# Altium schematic sheet C-03 eMMC_NAND_TF_QSPI.SchDoc
size 513 x 386 mm
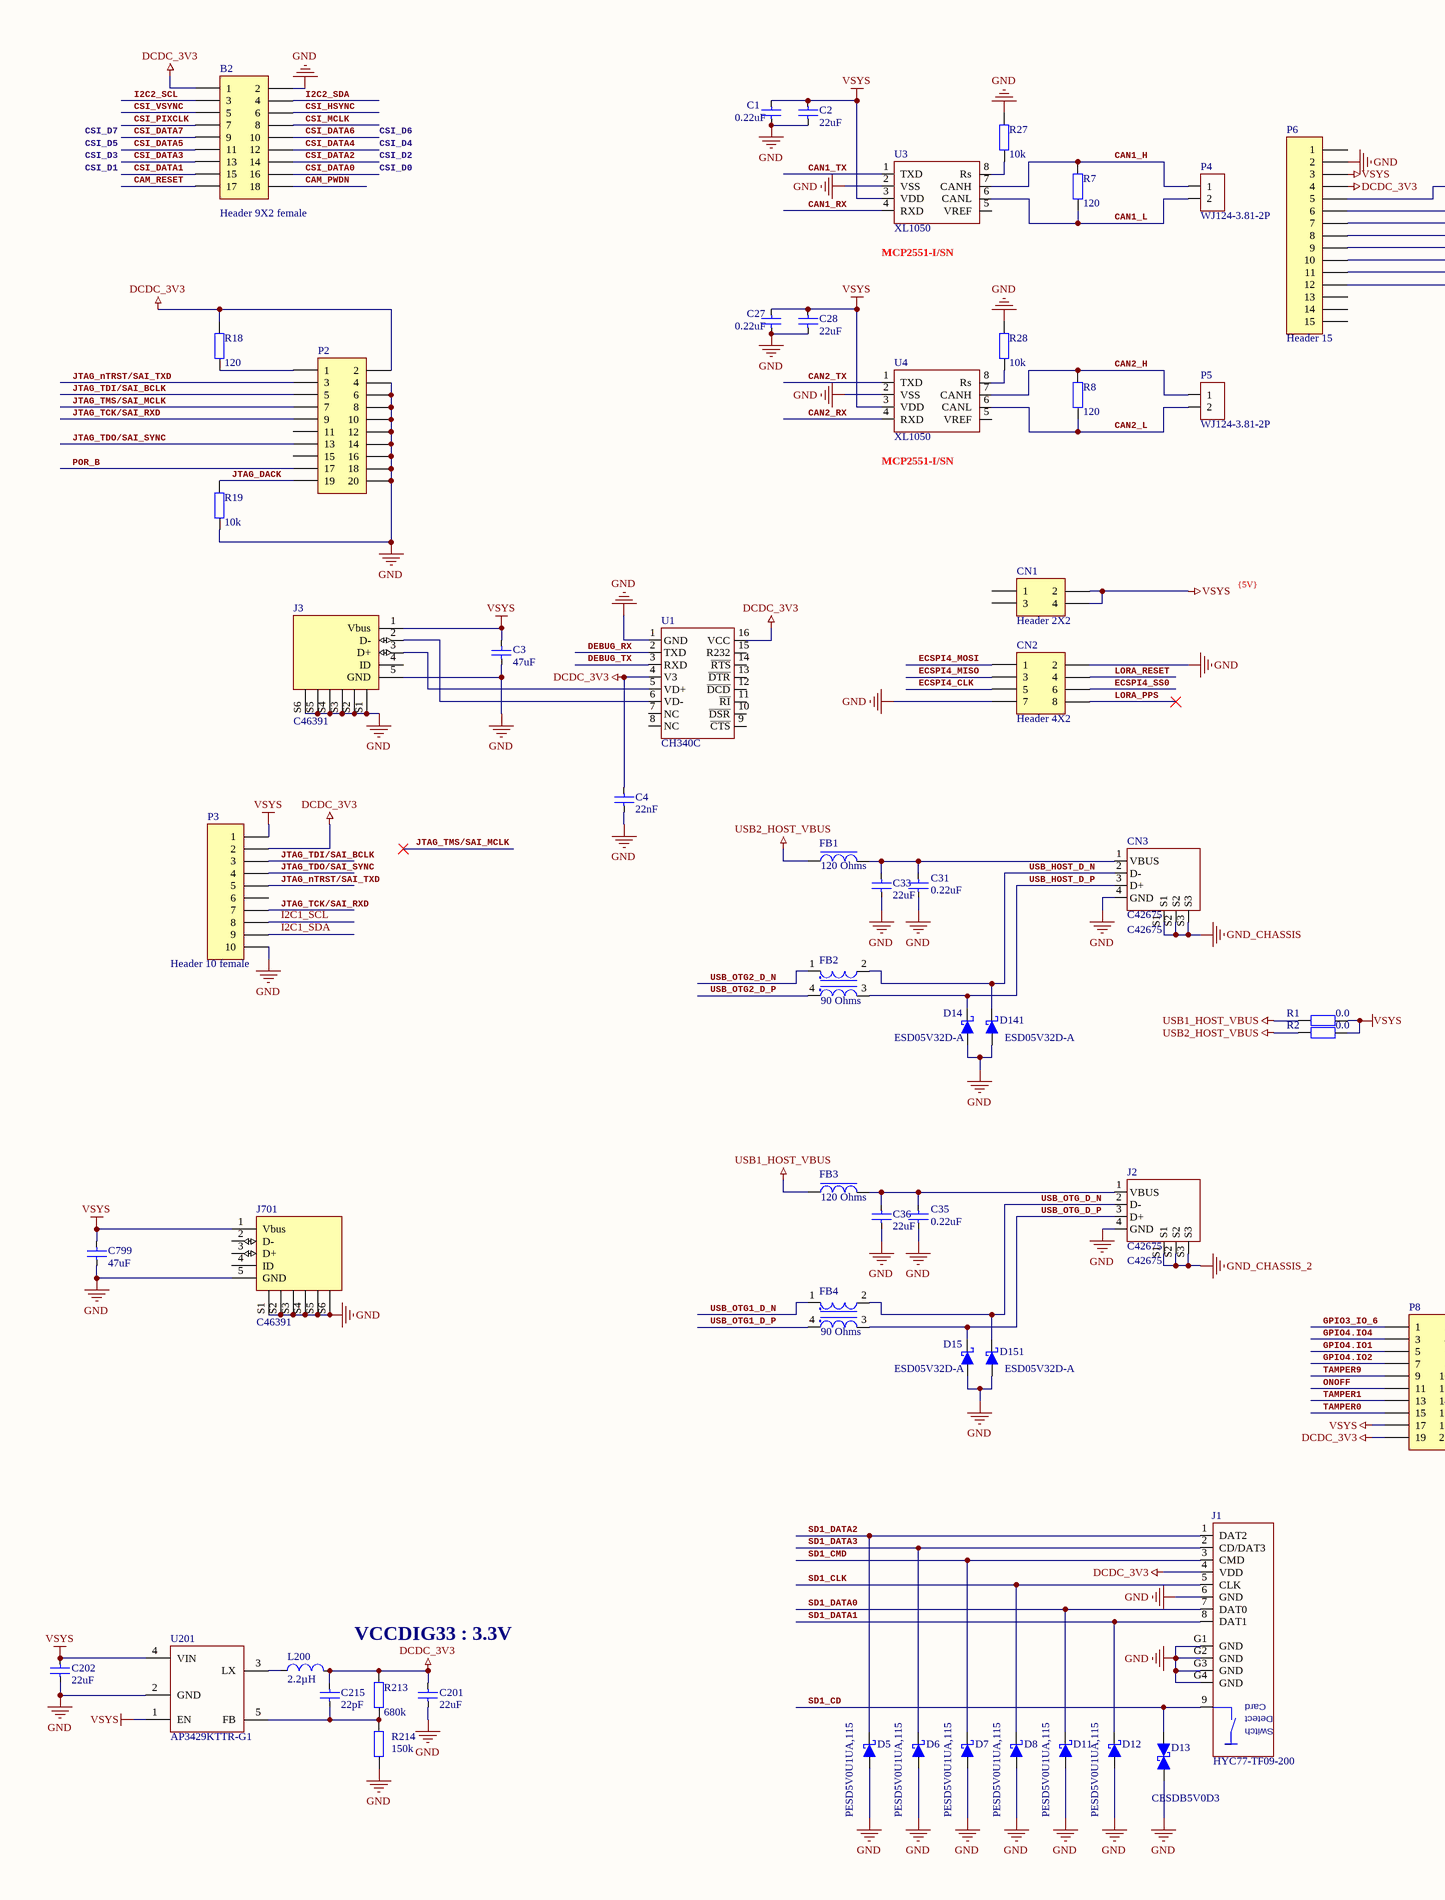
[diagram p0: C-03 eMMC_NAND_TF_QSPI.SchDoc, left]
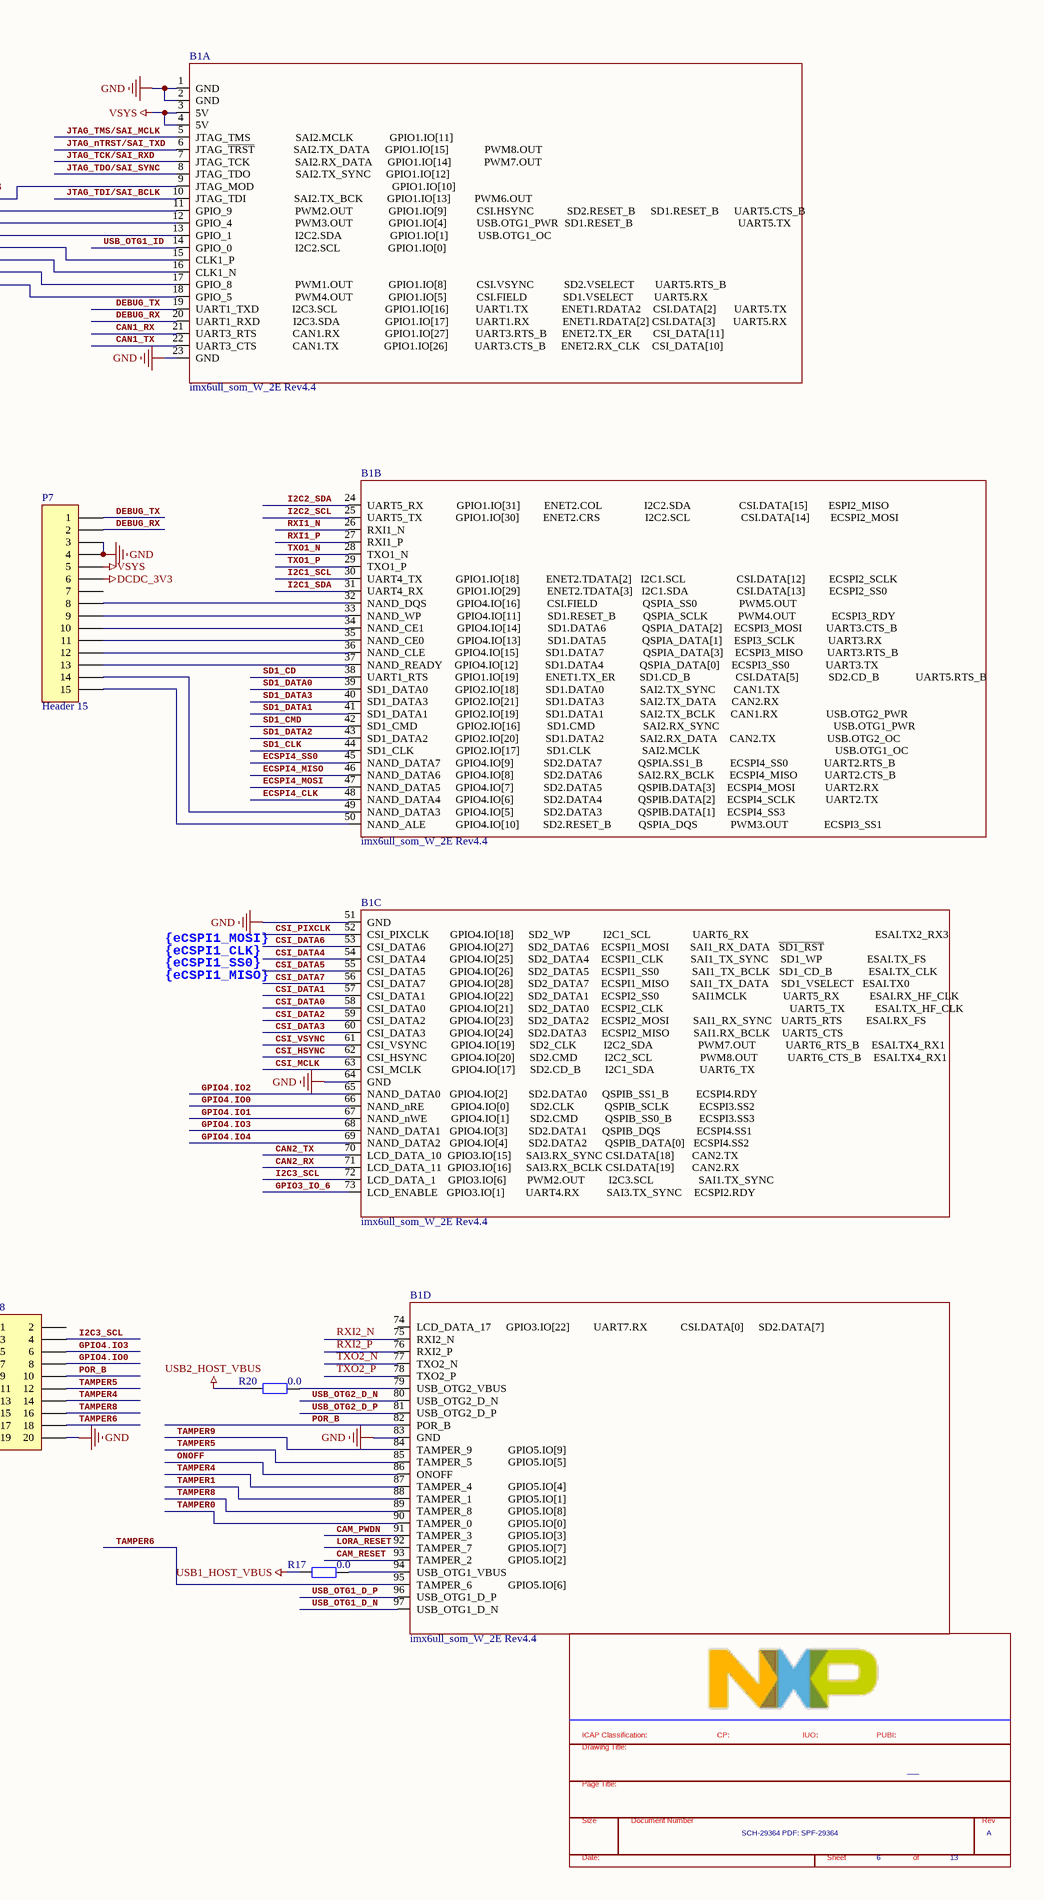
[diagram p1: C-03 eMMC_NAND_TF_QSPI.SchDoc, right]

## Parts
*  PUBI: ___  Doc: SCH-29364 PDF: SPF-29364  RevCode: A  Page Number: 6  Page Count: 13  (hidden comment: TitleBlock_FS)  (graphical)
B1  imx6ull_som_W_2E Rev4.4  [imx6ull_som]  (parts A,B,C,D of 4)
B2  Header 9X2 female  [HDR2X9]
C1  value 0.22uF  [CAP0603R]  (hidden comment: CL10B224KA8NNNC)
C2  value 22uF  [CAP1206R]  (hidden comment: CC1206KKX5R6BB226)
C3  value 47uF  [CAP1206R]  (hidden comment: CL31A476MPHNNNE)
C4  value 22nF  [CAP0603R]  (hidden comment: CC0603KRX7R9BB223)
C27  value 0.22uF  [CAP0603R]  (hidden comment: CL10B224KA8NNNC)
C28  value 22uF  [CAP1206R]  (hidden comment: CC1206KKX5R6BB226)
C31  value 0.22uF  [CAP0603R]  (hidden comment: CL10B224KA8NNNC)
C33  value 22uF  [CAP1206R]  (hidden comment: CC1206KKX5R6BB226)
C35  value 0.22uF  [CAP0603R]  (hidden comment: CL10B224KA8NNNC)
C36  value 22uF  [CAP1206R]  (hidden comment: CC1206KKX5R6BB226)
C201  value 22uF  [CAP1206R]  (hidden comment: CC1206KKX5R6BB226)
C202  value 22uF  [CAP1206R]  (hidden comment: CC1206KKX5R6BB226)
C215  value 22pF  [CAP0603R]  (hidden comment: CC0603JRNPO9BN220)
C799  value 47uF  [CAP1206R]  (hidden comment: CL31A476MPHNNNE)
CN1  Header 2X2  [HDR2X2]
CN2  Header 4X2  [HDR2X4]
CN3  C42675  [C2345-Footprint-1]
D5  PESD5V0U1UA,115  [SOD-323]
D6  PESD5V0U1UA,115  [SOD-323]
D7  PESD5V0U1UA,115  [SOD-323]
D8  PESD5V0U1UA,115  [SOD-323]
D11  PESD5V0U1UA,115  [SOD-323]
D12  PESD5V0U1UA,115  [SOD-323]
D13  CESDB5V0D3  [SOD-323]
D14  ESD05V32D-A  [SOD-323]
D15  ESD05V32D-A  [SOD-323]
D141  ESD05V32D-A  [SOD-323]
D151  ESD05V32D-A  [SOD-323]
FB1  Impedance: 120 Ohms  [0603]  (hidden comment: PZ1608U121-2R0TF)
FB2  Impedance: 90 Ohms  [DLW21HN900SQ2L-Footprint-1]  (hidden comment: DLW21HN900SQ2L)
FB3  Impedance: 120 Ohms  [0603]  (hidden comment: PZ1608U121-2R0TF)
FB4  Impedance: 90 Ohms  [DLW21HN900SQ2L-Footprint-1]  (hidden comment: DLW21HN900SQ2L)
J1  HYC77-TF09-200  [0473521001]
J2  C42675  [C2345-Footprint-1]
J3  C46391  [10118192]
J701  C46391  [10118192]
L200  value 2.2µH  [LQH3225]  (hidden comment: LQH32PN2R2NNCL)
P2  CMP-013-0009-2  [HDR2X10]  (value not drawn)
P3  Header 10 female  [HDR1X10]
P4  WJ124-3.81-2P  [SCREW1X2_3.81mm_pitch]
P5  WJ124-3.81-2P  [SCREW1X2_3.81mm_pitch]
P6  Header 15  [HDR1X15]
P7  Header 15  [HDR1X15]
P8  CMP-013-0009-2  [HDR2X10]  (value not drawn)
R1  value 0.0  [0603]  (hidden comment: CMP-022-0120-1)
R2  value 0.0  [0603]  (hidden comment: CMP-022-0120-1)
R7  value 120  [0603]  (hidden comment: 0603WAF1200T5E)
R8  value 120  [0603]  (hidden comment: 0603WAF1200T5E)
R17  value 0.0  [0603]  (hidden comment: RC0603JR-070RL)
R18  value 120  [0603]  (hidden comment: 0603WAF1200T5E)
R19  value 10k  [0603]  (hidden comment: 0603WAF1002T5E)
R20  value 0.0  [0603]  (hidden comment: CMP-022-0120-1)
R27  value 10k  [0603]  (hidden comment: 0603WAF1002T5E)
R28  value 10k  [0603]  (hidden comment: 0603WAF1002T5E)
R213  value 680k  [0603]  (hidden comment: 0603WAF6803T5E)
R214  value 150k  [0603]  (hidden comment: 0603WAF1503T5E)
U1  CH340C  [SOIC-16_N]
U3  XL1050  [SOIC-8_N]
U4  XL1050  [SOIC-8_N]
U201  AP3429KTTR-G1  [TSOT-23-5]

## Nets
DCDC_3V3: B2.1 C4.2 C201.1 C215.2 J1.4(VDD) L200.2 P2.2 P3.2 P6.4 P7.6 P8.19 R18.2 R213.2 U1.4(V3) U1.16(VCC)
GND: B1.1(GND) B1.2(GND) B1.23(GND) B1.51(GND) B1.64(GND) B1.83(GND) B2.2 C1.1 C2.2 C3.1 C4.1 C27.1 C28.2 C31.1 C33.2 C35.1 C36.2 C201.2 C202.2 C799.1 CN2.2 CN2.7 CN3.4(GND) D5.2(A) D6.2(A) D7.2(A) D8.2(A) D11.2(A) D12.2(A) D13.2(A) D14.2(A) D15.2(A) D141.2(A) D151.2(A) J1.6(GND) J1.G1(GND) J1.G2(GND) J1.G3(GND) J1.G4(GND) J2.4(GND) J3.5(GND) J3.S1 J3.S2 J3.S3 J3.S4 J3.S5 J3.S6 J701.5(GND) J701.S1 J701.S2 J701.S3 J701.S4 J701.S5 J701.S6 P2.4 P2.6 P2.8 P2.10 P2.12 P2.14 P2.16 P2.18 P2.20 P3.10 P6.2 P7.3 P7.4 P8.20 R19.1 R27.2 R28.2 R214.1 U1.1(GND) U3.2(VSS) U4.2(VSS) U201.2(GND)
GND_CHASSIS: CN3.S1 CN3.S2 CN3.S3
GND_CHASSIS_2: J2.S1 J2.S2 J2.S3
USB1_HOST_VBUS: FB3.2 R1.1 R17.1
USB2_HOST_VBUS: FB1.2 R2.1 R20.1
VSYS: B1.3(5V) B1.4(5V) C1.2 C2.1 C3.2 C27.2 C28.1 C202.1 C799.2 CN1.2 CN1.4 J3.1(Vbus) J701.1(Vbus) P3.1 P6.3 P7.5 P8.17 R1.2 R2.2 U3.3(VDD) U4.3(VDD) U201.1(EN) U201.4(VIN)
CAM_PWDN: B1.91(TAMPER_3____________GPIO5.IO[3]) B2.18
CAM_RESET: B1.93(TAMPER_2____________GPIO5.IO[2]) B2.17
CAN1_H: P4.1 R7.2 U3.7(CANH)
CAN1_L: P4.2 R7.1 U3.6(CANL)
CAN1_RX: B1.21(UART3_RTS____________CAN1.RX_______________GPIO1.IO[27]_________UART3.RTS_B_____ENET2.TX_ER_______CSI_DATA[11]) U3.4(RXD)
CAN1_TX: B1.22(UART3_CTS____________CAN1.TX_______________GPIO1.IO[26]_________UART3.CTS_B_____ENET2.RX_CLK____CSI_DATA[10]) U3.1(TXD)
CAN2_H: P5.1 R8.2 U4.7(CANH)
CAN2_L: P5.2 R8.1 U4.6(CANL)
CAN2_RX: B1.71(LCD_DATA_11__GPIO3.IO[16]_____SAI3.RX_BCLK_CSI.DATA[19]______CAN2.RX) U4.4(RXD)
CAN2_TX: B1.70(LCD_DATA_10__GPIO3.IO[15]_____SAI3.RX_SYNC_CSI.DATA[18]______CAN2.TX) U4.1(TXD)
CSI_DATA0: B1.58(CSI_DATA0________GPIO4.IO[21]_____SD2_DATA0____ECSPI2_CLK__________________________________________UART5_TX__________ESAI.TX_HF_CLK) B2.16
CSI_DATA1: B1.57(CSI_DATA1________GPIO4.IO[22]_____SD2_DATA1____ECSPI2_SS0___________SAI1MCLK____________UART5_RX__________ESAI.RX_HF_CLK) B2.15
CSI_DATA2: B1.59(CSI_DATA2________GPIO4.IO[23]_____SD2_DATA2____ECSPI2_MOSI________SAI1_RX_SYNC___UART5_RTS________ESAI.RX_FS) B2.14
CSI_DATA3: B1.60(CSI_DATA3________GPIO4.IO[24]_____SD2.DATA3_____ECSPI2_MISO________SAI1.RX_BCLK____UART5_CTS) B2.13
CSI_DATA4: B1.54(CSI_DATA4________GPIO4.IO[25]_____SD2_DATA4____ECSPI1_CLK_________SAI1_TX_SYNC____SD1_WP_______________ESAI.TX_FS) B2.12
CSI_DATA5: B1.55(CSI_DATA5________GPIO4.IO[26]_____SD2_DATA5____ECSPI1_SS0___________SAI1_TX_BCLK___SD1_CD_B____________ESAI.TX_CLK) B2.11
CSI_DATA6: B1.53(CSI_DATA6________GPIO4.IO[27]_____SD2_DATA6____ECSPI1_MOSI_______SAI1_RX_DATA___~{SD1_RST}) B2.10
CSI_DATA7: B1.56(CSI_DATA7________GPIO4.IO[28]_____SD2_DATA7____ECSPI1_MISO_______SAI1_TX_DATA____SD1_VSELECT___ESAI.TX0) B2.9
CSI_HSYNC: B1.62(CSI_HSYNC________GPIO4.IO[20]_____SD2.CMD_________I2C2_SCL________________PWM8.OUT__________UART6_CTS_B____ESAI.TX4_RX1) B2.6
CSI_MCLK: B1.63(CSI_MCLK__________GPIO4.IO[17]_____SD2.CD_B________I2C1_SDA_______________UART6_TX) B2.8
CSI_PIXCLK: B1.52(CSI_PIXCLK_______GPIO4.IO[18]_____SD2_WP___________I2C1_SCL______________UART6_RX__________________________________________ESAI.TX2_RX3) B2.7
CSI_VSYNC: B1.61(CSI_VSYNC________GPIO4.IO[19]_____SD2_CLK_________I2C2_SDA_______________PWM7.OUT__________UART6_RTS_B____ESAI.TX4_RX1) B2.5
DEBUG_RX: B1.20(UART1_RXD___________I2C3.SDA_______________GPIO1.IO[17]_________UART1.RX___________ENET1.RDATA[2]_CSI.DATA[3]______UART5.RX) P7.2 U1.2(TXD)
DEBUG_TX: B1.19(UART1_TXD___________I2C3.SCL________________GPIO1.IO[16]_________UART1.TX___________ENET1.RDATA2____CSI.DATA[2]______UART5.TX) P7.1 U1.3(RXD)
ECSPI4_CLK: B1.48(NAND_DATA4_____GPIO4.IO[6]__________SD2.DATA4____________QSPIB.DATA[2]____ECSPI4_SCLK__________UART2.TX) CN2.5
ECSPI4_MISO: B1.46(NAND_DATA6_____GPIO4.IO[8]__________SD2.DATA6____________SAI2.RX_BCLK_____ECSPI4_MISO_________UART2.CTS_B) CN2.3
ECSPI4_MOSI: B1.47(NAND_DATA5_____GPIO4.IO[7]__________SD2.DATA5____________QSPIB.DATA[3]____ECSPI4_MOSI__________UART2.RX) CN2.1
ECSPI4_SS0: B1.45(NAND_DATA7_____GPIO4.IO[9]__________SD2.DATA7____________QSPIA.SS1_B_________ECSPI4_SS0____________UART2.RTS_B) CN2.6
GPIO3_IO_6: B1.73(LCD_ENABLE___GPIO3.IO[1]_______UART4.RX_________SAI3.TX_SYNC____ECSPI2.RDY) P8.1
GPIO4.IO0: B1.66(NAND_nRE_________GPIO4.IO[0]_______SD2.CLK__________QSPIB_SCLK__________ECSPI3.SS2) P8.8
GPIO4.IO1: B1.67(NAND_nWE________GPIO4.IO[1]_______SD2.CMD_________QSPIB_SS0_B_________ECSPI3.SS3) P8.5
GPIO4.IO2: B1.65(NAND_DATA0___GPIO4.IO[2]_______SD2.DATA0_____QSPIB_SS1_B_________ECSPI4.RDY) P8.7
GPIO4.IO3: B1.68(NAND_DATA1___GPIO4.IO[3]_______SD2.DATA1_____QSPIB_DQS____________ECSPI4.SS1) P8.6
GPIO4.IO4: B1.69(NAND_DATA2___GPIO4.IO[4]_______SD2.DATA2______QSPIB_DATA[0]___ECSPI4.SS2) P8.3
I2C1_SCL: B1.30(UART4_TX___________GPIO1.IO[18]_________ENET2.TDATA[2]___I2C1.SCL_________________CSI.DATA[12]________ECSPI2_SCLK) P3.8
I2C1_SDA: B1.31(UART4_RX___________GPIO1.IO[29]_________ENET2.TDATA[3]___I2C1.SDA________________CSI.DATA[13]________ECSPI2_SS0) P3.9
I2C2_SCL: B1.25(UART5_TX___________GPIO1.IO[30]________ENET2.CRS_______________I2C2.SCL_________________CSI.DATA[14]_______ECSPI2_MOSI) B2.3
I2C2_SDA: B1.24(UART5_RX___________GPIO1.IO[31]________ENET2.COL______________I2C2.SDA________________CSI.DATA[15]_______ESPI2_MISO) B2.4
I2C3_SCL: B1.72(LCD_DATA_1____GPIO3.IO[6]_______PWM2.OUT________I2C3.SCL_______________SAI1.TX_SYNC) P8.4
JTAG_DACK: P2.19 R19.2
JTAG_nTRST/SAI_TXD: B1.6(JTAG_~{TRST}_____________SAI2.TX_DATA_____GPIO1.IO[15]____________PWM8.OUT) P2.3 P3.5
JTAG_TCK/SAI_RXD: B1.7(JTAG_TCK_______________SAI2.RX_DATA_____GPIO1.IO[14]___________PWM7.OUT) P2.9 P3.7
JTAG_TDI/SAI_BCLK: B1.10(JTAG_TDI________________SAI2.TX_BCK________GPIO1.IO[13]________PWM6.OUT) P2.5 P3.3
JTAG_TDO/SAI_SYNC: B1.8(JTAG_TDO_______________SAI2.TX_SYNC_____GPIO1.IO[12]) P2.13 P3.4
JTAG_TMS/SAI_MCLK: B1.5(JTAG_TMS_______________SAI2.MCLK____________GPIO1.IO[11]) P2.7
LORA_PPS: CN2.8
LORA_RESET: B1.92(TAMPER_7____________GPIO5.IO[7]) CN2.4
ONOFF: B1.86(ONOFF) P8.11
POR_B: B1.82(POR_B) P2.17 P8.10
RXI1_N: B1.26(RXI1_N)
RXI1_P: B1.27(RXI1_P)
RXI2_N: B1.75(RXI2_N)
RXI2_P: B1.76(RXI2_P)
SD1_CD: B1.38(UART1_RTS_________GPIO1.IO[19]_________ENET1.TX_ER________SD1.CD_B_______________CSI.DATA[5]__________SD2.CD_B____________UART5.RTS_B) D13.1(K) J1.9(CDSW)
SD1_CLK: B1.44(SD1_CLK______________GPIO2.IO[17]_________SD1.CLK_________________SAI2.MCLK_____________________________________________USB.OTG1_OC) D8.1(K) J1.5(CLK)
SD1_CMD: B1.42(SD1_CMD_____________GPIO2.IO[16]_________SD1.CMD________________SAI2.RX_SYNC______________________________________USB.OTG1_PWR) D7.1(K) J1.3(CMD)
SD1_DATA0: B1.39(SD1_DATA0_________GPIO2.IO[18]_________SD1.DATA0____________SAI2.TX_SYNC______CAN1.TX) D11.1(K) J1.7(DAT0)
SD1_DATA1: B1.41(SD1_DATA1_________GPIO2.IO[19]_________SD1.DATA1____________SAI2.TX_BCLK_____CAN1.RX________________USB.OTG2_PWR) D12.1(K) J1.8(DAT1)
SD1_DATA2: B1.43(SD1_DATA2_________GPIO2.IO[20]_________SD1.DATA2____________SAI2.RX_DATA____CAN2.TX_________________USB.OTG2_OC) D5.1(K) J1.1(DAT2)
SD1_DATA3: B1.40(SD1_DATA3_________GPIO2.IO[21]_________SD1.DATA3____________SAI2.TX_DATA_____CAN2.RX) D6.1(K) J1.2(CD/DAT3)
TAMPER0: B1.90(TAMPER_0____________GPIO5.IO[0]) P8.15
TAMPER1: B1.88(TAMPER_1____________GPIO5.IO[1]) P8.13
TAMPER4: B1.87(TAMPER_4____________GPIO5.IO[4]) P8.14
TAMPER5: B1.85(TAMPER_5____________GPIO5.IO[5]) P8.12
TAMPER6: B1.95(TAMPER_6____________GPIO5.IO[6]) P8.18
TAMPER8: B1.89(TAMPER_8____________GPIO5.IO[8]) P8.16
TAMPER9: B1.84(TAMPER_9____________GPIO5.IO[9]) P8.9
TXO1_N: B1.28(TXO1_N)
TXO1_P: B1.29(TXO1_P)
TXO2_N: B1.77(TXO2_N)
TXO2_P: B1.78(TXO2_P)
USB_HOST_D_N: CN3.2(D-) D141.1(K) FB2.2
USB_HOST_D_P: CN3.3(D+) D14.1(K) FB2.3
USB_OTG1_D_N: B1.97(USB_OTG1_D_N) FB4.1
USB_OTG1_D_P: B1.96(USB_OTG1_D_P) FB4.4
USB_OTG1_ID: B1.14(GPIO_0_____________________I2C2.SCL________________GPIO1.IO[0])
USB_OTG2_D_N: B1.80(USB_OTG2_D_N) FB2.1
USB_OTG2_D_P: B1.81(USB_OTG2_D_P) FB2.4
USB_OTG_D_N: D151.1(K) FB4.2 J2.2(D-)
USB_OTG_D_P: D15.1(K) FB4.3 J2.3(D+)
NetB1_9: B1.9(JTAG_MOD______________________________________________GPIO1.IO[10]) P6.5
NetB1_11: B1.11(GPIO_9_____________________PWM2.OUT____________GPIO1.IO[9]__________CSI.HSYNC___________SD2.RESET_B_____SD1.RESET_B_____UART5.CTS_B) P6.6
NetB1_12: B1.12(GPIO_4_____________________PWM3.OUT____________GPIO1.IO[4]__________USB.OTG1_PWR__SD1.RESET_B___________________________________UART5.TX) P6.7
NetB1_13: B1.13(GPIO_1_____________________I2C2.SDA________________GPIO1.IO[1]__________USB.OTG1_OC) P6.8
NetB1_15: B1.15(CLK1_P) P6.9
NetB1_16: B1.16(CLK1_N) P6.10
NetB1_17: B1.17(GPIO_8_____________________PWM1.OUT____________GPIO1.IO[8]__________CSI.VSYNC__________SD2.VSELECT_______UART5.RTS_B) P6.11
NetB1_18: B1.18(GPIO_5_____________________PWM4.OUT____________GPIO1.IO[5]__________CSI.FIELD____________SD1.VSELECT_______UART5.RX) P6.12
NetB1_32: B1.32(NAND_DQS__________GPIO4.IO[16]_________CSI.FIELD_______________QSPIA_SS0______________PWM5.OUT) P7.8
NetB1_33: B1.33(NAND_WP____________GPIO4.IO[11]_________SD1.RESET_B_________QSPIA_SCLK__________PWM4.OUT____________ECSPI3_RDY) P7.9
NetB1_34: B1.34(NAND_CE1___________GPIO4.IO[14]_________SD1.DATA6____________QSPIA_DATA[2]____ECSPI3_MOSI________UART3.CTS_B) P7.10
NetB1_35: B1.35(NAND_CE0___________GPIO4.IO[13]_________SD1.DATA5____________QSPIA_DATA[1]____ESPI3_SCLK___________UART3.RX) P7.11
NetB1_36: B1.36(NAND_CLE__________GPIO4.IO[15]_________SD1.DATA7_____________QSPIA_DATA[3]____ECSPI3_MISO________UART3.RTS_B) P7.12
NetB1_37: B1.37(NAND_READY____GPIO4.IO[12]_________SD1.DATA4____________QSPIA_DATA[0]____ECSPI3_SS0____________UART3.TX) P7.13
NetB1_49: B1.49(NAND_DATA3_____GPIO4.IO[5]__________SD2.DATA3____________QSPIB.DATA[1]____ECSPI4_SS3) P7.14
NetB1_50: B1.50(NAND_ALE__________GPIO4.IO[10]________SD2.RESET_B_________QSPIA_DQS___________PWM3.OUT____________ECSPI3_SS1) P7.15
NetB1_79: B1.79(USB_OTG2_VBUS) R20.2
NetB1_94: B1.94(USB_OTG1_VBUS) R17.2
NetC31_2: C31.2 C33.1 CN3.1(VBUS) FB1.1
NetC35_2: C35.2 C36.1 FB3.1 J2.1(VBUS)
NetC215_1: C215.1 R213.1 R214.2 U201.5(FB)
NetJ3_2: J3.2(D-) U1.6(VD-)
NetJ3_3: J3.3(D+) U1.5(VD+)
NetL200_1: L200.1 U201.3(LX)
NetP2_1: P2.1 R18.1
NetR27_1: R27.1 U3.8(Rs)
NetR28_1: R28.1 U4.8(Rs)

Not connected (* = marked no-connect by the designer): B1 74(LCD_DATA_17_____GPIO3.IO[22]________UART7.RX___________CSI.DATA[0]_____SD2.DATA[7]); CN1 1 3; J3 4(ID); J701 2(D-) 3(D+) 4(ID); P2 11 15; P3 6; P6 1 13 14 15; P7 7; P8 2; U1 7(NC) 8(NC) 9(~{CTS}) 10(~{DSR}) 11(~{RI}) 12(~{DCD}) 13(~{DTR}) 14(~{RTS}) 15(R232); U3 5(VREF); U4 5(VREF)

## Notes on the sheet
- CSI_D1
- CSI_D3
- CSI_D5
- CSI_D7
- CSI_D0
- CSI_D2
- CSI_D4
- CSI_D6
- (near U3) MCP2551-I/SN
- (near U4) MCP2551-I/SN
- {5V}
- {eCSPI1_MOSI}
- {eCSPI1_CLK}
- {eCSPI1_SS0}
- {eCSPI1_MISO}
- VCCDIG33 : 3.3V
- (in symbol CMP-00146-1) Card; Detect; Switch
- (in symbol TitleBlock_FS) ICAP Classification:; CP:; IUO:; PUBI:; Drawing Title:; Page Title:; Size; Document Number; Rev; Date:; Sheet; of

## Library data of the parts
* = TitleBlock_FS: OrgAddr2: Austin, TX 78735-8598; OrgAddr1: 6501 William Cannon Drive West; OrgName: Freescale Semiconductor; Page Create Date: March  8, 1995
B1 = CMP-00216-1: IMX6ULL SOM 2Eth + WiFi version Rev4.4; Manufacturer: m2m-tele.com; PriceQty: 1; Price: 12,0; Component Name: imx6ull_som_W_2E; Designator: imx6ull_som_W_2E; Pin Count: 77
B2 = CMP-00205-1: Header, 9-Pin, Dual row; Part Number: C71956; Manufacturer: BOOMELE; Signal Integrity: Connector; HelpURL: https://lcsc.com/product-detail/Pin-Header-Female-Header_BOOMELE-Boom-Precision-Elec-C71956_C71956.html; Price: 0,0585; PriceQty: 50; PriceSupplier: https://lcsc.com/product-detail/Pin-Header-Female-Header_BOOMELE-Boom-Precision-Elec-C71956_C71956.html; Component Name: Header 9X2; Pin Count: 18
C1 C27 C31 C35 = CMP-00194-1: CAP CER 0.1UF 50V ±10% X7R 0603; Manufacturer: Samsung; Voltage: 25V; Designator: CL10B224KA8NNNC; HelpURL: https://lcsc.com/product-detail/Multilayer-Ceramic-Capacitors-MLCC-SMD-SMT_SAMSUNG_CL10B224KA8NNNC_220nF-224-10-25V_C21120.html; PriceQty: 50; Component Name: CL10B224KA8NNNC; Part Number: CL10B224KA8NNNC; Temperature: -55°C ~ 125°C; Tolerance: ±10%; Technology: X7R; Price: 0,0074; Signal Integrity: Cap; Pin Count: 2; Simulation: CAP; PriceSupplier: https://lcsc.com/product-detail/Multilayer-Ceramic-Capacitors-MLCC-SMD-SMT_SAMSUNG_CL10B224KA8NNNC_220nF-224-10-25V_C21120.html
C2 C28 C33 C36 = CMP-004-0058-1: CAP CER 22UF 10V ±10% X5R 1206; Manufacturer: Yageo; Tolerance: ±10%; Voltage: 10V; Technology: X5R; Part Number: CC1206KKX5R6BB226; Temperature: -55°C ~ 125°C; HelpURL: https://www.digikey.com/product-detail/en/yageo/CC1206KKX5R6BB226/311-1939-1-ND/5195841; Price: 0,0378; PriceQty: 100; PriceSupplier: https://lcsc.com/product-detail/Multilayer-Ceramic-Capacitors-MLCC-SMD-SMT_22uF-226-10-10V_C110046.html; Component Name: CC1206KKX5R6BB226; Pin Count: 2; Signal Integrity: Cap; Simulation: CAP
C3 C799 = CMP-00176-1: CAP CER 47UF 10V ±10% X5R 1206; Manufacturer: Yageo; Tolerance: ±20%; Part Number: CL31A476MPHNNNE; Technology: X5R; PriceSupplier: https://lcsc.com/product-detail/Multilayer-Ceramic-Capacitors-MLCC-SMD-SMT_SAMSUNG_CL31A476MPHNNNE_47uF-476-20-10V_C96123.html/?href=jlc-SMT; PriceQty: 1; HelpURL: https://lcsc.com/product-detail/Multilayer-Ceramic-Capacitors-MLCC-SMD-SMT_SAMSUNG_CL31A476MPHNNNE_47uF-476-20-10V_C96123.html/?href=jlc-SMT; Temperature: -55°C ~ 85°C; Pin Count: 2; Designator: CL31A476MPHNNNE; Simulation: CAP; Voltage: 10V; Price: 0,0988; Component Name: CL31A476MPHNNNE; Signal Integrity: Cap
C4 = CMP-004-0047-1: CAP CER 0.022UF 50V ±10% X7R 0603; Manufacturer: Yageo; Component Name: CC0603KRX7R9BB223; Designator: CC0603KRX7R9BB223; HelpURL: https://www.digikey.com/product-detail/en/yageo/CC0603KRX7R9BB223/311-1370-1-ND/2103154; Part Number: CC0603KRX7R9BB223; Pin Count: 2; Price: 0,021; PriceQty: 1; PriceSupplier: https://www.promelec.ru/product/148489/; Signal Integrity: Cap; Simulation: CAP; Technology: X7R; Temperature: -55°C ~ 125°C; Tolerance: ±10%; Voltage: 50V
C201 C202 = CC1206KKX5R6BB226: CAP CER 22UF 10V ±10% X5R 1206; Manufacturer: Yageo; Tolerance: ±10%; Voltage: 10V; Technology: X5R; Part Number: CC1206KKX5R6BB226; Temperature: -55°C ~ 125°C; HelpURL: https://www.digikey.com/product-detail/en/yageo/CC1206KKX5R6BB226/311-1939-1-ND/5195841; Price: 0,0378; PriceQty: 100; PriceSupplier: https://lcsc.com/product-detail/Multilayer-Ceramic-Capacitors-MLCC-SMD-SMT_22uF-226-10-10V_C110046.html
C215 = CMP-00198-1: CAP CER 22PF 50V ±1% NPO 0603; Manufacturer: Yageo; Price: 0,0033; HelpURL: https://www.digikey.com/en/products/detail/yageo/CC0603JRNPO9BN220/302796; Tolerance: ±1%; PriceQty: 100; Temperature: -55°C ~ 125°C; Technology: C0G, NP0; Voltage: 50V; Pin Count: 2; Signal Integrity: Cap; Simulation: CAP; Designator: CC0603JRNPO9BN220; PriceSupplier: https://lcsc.com/product-detail/Multilayer-Ceramic-Capacitors-MLCC-SMD-SMT_YAGEO-CC0603JRNPO9BN220_C105620.html; Part Number: CC0603JRNPO9BN220; Component Name: CC0603JRNPO9BN220
CN1 = CMP-013-0038-2: Header, 2-Pin, Dual row; Part Number: 210-72-02GB01; Manufacturer: PINREX; Signal Integrity: Connector; Temperature: -40 to 105C; HelpURL: https://lcsc.com/product-detail/Pin-Header-Female-Header_PINREX-210-72-02GB01_C402780.html; Component Name: Header 2X2; Pin Count: 4; PriceSupplier: https://lcsc.com/product-detail/Pin-Header-Female-Header_PINREX-210-72-02GB01_C402780.html; Price: 0,0137; PriceQty: 50
CN2 = CMP-013-0046-2: Header, 4-Pin, Dual row; Part Number: MTP125-1204S1; Signal Integrity: Connector; Designator: Header 4X2; Component Name: Header 4X2; PriceSupplier: https://lcsc.com/product-detail/Pin-Header-Female-Header_MINTRON-MTP125-1204S1_C358693.html; HelpURL: https://lcsc.com/product-detail/Pin-Header-Female-Header_MINTRON-MTP125-1204S1_C358693.html; Price: 0,0329; Pin Count: 8; Temperature: -40 to 105C; PriceQty: 20
CN3 J2 = CMP-00188-2: USB - Type A Female USB 2 4 Through Hole USB Connector; Manufacturer: Jing Extension of the Electronic Co; Component Name: C42675; Temperature: -35°C ~ 85°C; PriceSupplier: https://lcsc.com/product-detail/USB-Connectors_Jing-Extension-of-the-Electronic-Co-A-F9013-65O-Vinyl-Not-high-temperature_C42675.html; Pin Count: 4; HelpURL: https://lcsc.com/product-detail/USB-Connectors_Jing-Extension-of-the-Electronic-Co-A-F9013-65O-Vinyl-Not-high-temperature_C42675.html; Price: 0,0412; Part Number: C42675; PriceQty: 100
D5-D8 D11 D12 = CMP-00195-1: TVS DIODE 5V SOD323; Manufacturer: Diodes Incorporated; PriceSupplier: https://lcsc.com/product-detail/Diodes-ESD_Nexperia-PESD5V0U1UA-115_C139614.html; Component Name: PESD5V0U1UA,115; Designator: PESD5V0U1UA,115; PriceQty: 50; Part Number: PESD5V0U1UA,115; Temperature: -55°C ~ 150°C (TA); Price: 0,0528; Pin Count: 2; HelpURL: https://www.digikey.com/en/products/detail/nexperia-usa-inc/PESD5V0U1UA115/1992975
D13 = CMP-00196-2: Bidirectional 5V (Max) 5.8V SOD-323 Diode; Manufacturer: Changjiang Electronics Tech; Part Number: CESDB5V0D3; Pin Count: 2; Temperature: -55°C ~ 150°C (TA); Price: 0,0253; PriceSupplier: https://lcsc.com/product-detail/Diodes-ESD_Changjiang-Electronics-Tech-CJ-CESDB5V0D3_C154987.html; Component Name: CESDB5V0D3; PriceQty: 20; HelpURL: https://lcsc.com/product-detail/Diodes-ESD_Changjiang-Electronics-Tech-CJ-CESDB5V0D3_C154987.html
D14 D15 D141 D151 = CMP-00204-1: TVS DIODE 5V SOD323; Manufacturer: SOCAY; HelpURL: https://lcsc.com/product-detail/TVS_SOCAY-Elec-ESD05V32D-A_C303800.html; Component Name: ESD05V32D-A; Price: 0,0514; Part Number: ESD05V32D-A; PriceSupplier: https://lcsc.com/product-detail/TVS_SOCAY-Elec-ESD05V32D-A_C303800.html; Pin Count: 2; Designator: ESD05V32D-A; Temperature: -55°C ~ 150°C (TA); PriceQty: 20
FB1 FB3 = CMP-00148-1: FERRITE BEAD 120 OHM 0603 2A; Manufacturer: Sunlord; Value: 120 Ohms @ 100MHz; Designator: PZ1608U121-2R0TF; Component Name: PZ1608U121-2R0TF; Part number: PZ1608U121-2R0TF; HelpURL: https://lcsc.com/product-detail/Ferrite-Beads_Sunlord-PZ1608U121-2R0TF_C304464.html; Current: 2A; PriceSupplier: https://lcsc.com/product-detail/Ferrite-Beads_Sunlord-PZ1608U121-2R0TF_C304464.html; Temperature: -55°C ~ 125°C; PriceQty: 50; Price: 0,0048; Pin Count: 2
FB2 FB4 = CMP-00150-1: CMC 330MA 2LN 90 OHM SMD; Manufacturer: Murata Electronics North America; Value: 90 Ohms @ 100MHz; Temperature: -40°C ~ 85°C; PriceSupplier: https://lcsc.com/product-detail/Common-Mode-Chokes-Filters_Murata-Electronics_DLW21HN900SQ2L-CUTTAPE_Murata-Electronics-DLW21HN900SQ2L-CUTTAPE_C80529.html; Price: 0,04812; Designator: DLW21HN900SQ2L; Component Name: DLW21HN900SQ2L; HelpURL: https://www.digikey.com/product-detail/en/murata-electronics/DLW21HN900SQ2L/490-1064-1-ND/584510; Pin Count: 2; PriceQty: 50; Part number: DLW21HN900SQ2L; Current: 330mA
J1 = CMP-00146-1: CONN MICRO SD CARD PUSH-PUSH R/A; Manufacturer: Molex, LLC; Designator: HYC77-TF09-200; Pin Count: 13; Part Number: HYC77-TF09-200; Price: 0,0783; PriceSupplier: https://lcsc.com/product-detail/Card-Sockets-Connectors_HOAUC-HYC77-TF09-200_C341092.html; PriceQty: 50; Component Name: HYC77-TF09-200; HelpURL: https://lcsc.com/product-detail/Card-Sockets-Connectors_HOAUC-HYC77-TF09-200_C341092.html
J3 J701 = CMP-00201-1: CONN USB MICRO B RECPT SMT R/A; Manufacturer: Jing Extension of the Electronic Co; Temperature: -30°C ~ 80°C; HelpURL: https://lcsc.com/product-detail/USB-Connectors_Jing-Extension-of-the-Electronic-Co-MINI-5PMotherboard-Copper-shell-with-column-LCPVinyl-Without-high-temperature-glue-High-temperature_C46391.html; Component Name: C46391; Pin Count: 11; PriceSupplier: https://lcsc.com/product-detail/USB-Connectors_Jing-Extension-of-the-Electronic-Co-MINI-5PMotherboard-Copper-shell-with-column-LCPVinyl-Without-high-temperature-glue-High-temperature_C46391.html; PriceQty: 50; Price: 0,0561; Designator: C46391; Part Number: C46391
L200 = LQH32PN2R2NNCL: FIXED IND 2.2UH 1.85A 76.8 MOHM; Manufacturer: Murata Electronics North America; Tolerance: ±30%; Part Number: LQH32PN2R2NNCL; Temperature: -40°C ~ 85°C; HelpURL: https://www.digikey.com/product-detail/en/murata-electronics-north-america/LQH32PN2R2NNCL/490-12036-1-ND/5403111; Price: 0,088; PriceQty: 100; PriceSupplier: https://lcsc.com/product-detail/New-Arrivals_Murata-Electronics-LQH32PN2R2NNCL_C389569.html
P2 P8 = CMP-013-0009-2: Header, 10-Pin, Dual row; Part Number: MTP125-1210S1; Manufacturer: MINTRON; Component Name: Header 10X2; Signal Integrity: Connector; Temperature: -40 to 105C; HelpURL: https://lcsc.com/product-detail/Pin-Header-Female-Header_MINTRON-MTP125-1210S1_C358699.html; Price: 0,06; PriceQty: 50; PriceSupplier: https://lcsc.com/product-detail/Pin-Header-Female-Header_MINTRON-MTP125-1210S1_C358699.html; Pin Count: 20
P3 = CMP-00206-1: Header, 10-Pin; Part Number: C35445; Manufacturer: BOOMELE; Signal Integrity: Connector; Component Name: Header 10; Pin Count: 10; Price: 0,041; PriceSupplier: https://lcsc.com/product-detail/Pin-Header-Female-Header_BOOMELE-Boom-Precision-Elec-C35445_C35445.html; PriceQty: 100; HelpURL: https://lcsc.com/product-detail/Pin-Header-Female-Header_BOOMELE-Boom-Precision-Elec-C35445_C35445.html; Temperature: -40 to 105C
P4 P5 = CMP-00202-1: TERM BLK 2P SIDE ENT 3.81MM PCB; Manufacturer: Ningbo Kangnex Elec; Signal Integrity: Connector; Part Number: WJ124-3.81-2P; HelpURL: https://lcsc.com/product-detail/Screw-terminal_Ningbo-Kangnex-Elec-WJ124-3-81-2P_C69811.html; Temperature: -40°C ~ 110°C; Designator: WJ124-3.81-2P; PriceSupplier: https://lcsc.com/product-detail/Screw-terminal_Ningbo-Kangnex-Elec-WJ124-3-81-2P_C69811.html; PriceQty: 100; Component Name: WJ124-3.81-2P; Pin Count: 2; Price: 0,0908
P6 P7 = CMP-013-0027-2: Header, 15-Pin; Part Number: C124373; Manufacturer: Ckmtw; Signal Integrity: Connector; Component Name: Header 15; Pin Count: 15; Price: 0,0572; PriceQty: 50; Temperature: -40 to 105C; PriceSupplier: https://lcsc.com/product-detail/Pin-Header-Female-Header_Ckmtw-Shenzhen-Cankemeng-Headers-Pins-1-15P-2-54mm-Straight-line_C124373.html; HelpURL: https://lcsc.com/product-detail/Pin-Header-Female-Header_Ckmtw-Shenzhen-Cankemeng-Headers-Pins-1-15P-2-54mm-Straight-line_C124373.html
R1 R2 R20 = CMP-022-0120-1: RES SMD 0 OHM JUMPER 1/10W 0603; Part Number: RC0603JR-070RL; Manufacturer: Yageo; Temperature: -55°C ~ 155°C; HelpURL: https://www.digikey.com/product-detail/en/yageo/RC0603JR-070RL/311-0.0GRCT-ND/729622; Price: 0,0060; PriceQty: 1; PriceSupplier: https://www.promelec.ru/product/22798/; Component Name: RC0603JR-070RL; Pin Count: 2; Signal Integrity: Res; Simulation: RESISTOR
R7 R8 R18 = CMP-00192-1: RES SMD 120 OHM 1% 1/10W 0603; Manufacturer: Uniroyal; HelpURL: https://lcsc.com/product-detail/Chip-Resistor-Surface-Mount_Uniroyal-Elec-0603WAF1200T5E_C22787.html; Part Number: 0603WAF1200T5E; Price: 0,0018; Tolerance: ±1%; PriceQty: 100; Signal Integrity: Res; Simulation: RESISTOR; Temperature: -55°C ~ 155°C; Designator: 0603WAF1200T5E; PriceSupplier: https://lcsc.com/product-detail/Chip-Resistor-Surface-Mount_Uniroyal-Elec-0603WAF1200T5E_C22787.html; Pin Count: 1; Component Name: 0603WAF1200T5E
R17 = RC0603JR-070RL: RES SMD 0 OHM JUMPER 1/10W 0603; Manufacturer: Yageo; Part Number: RC0603JR-070RL; Temperature: -55°C ~ 155°C; HelpURL: https://www.digikey.com/product-detail/en/yageo/RC0603JR-070RL/311-0.0GRCT-ND/729622; Price: 0,0060; PriceQty: 1; PriceSupplier: https://www.promelec.ru/product/22798/
R19 R27 R28 = CMP-00193-1: RES SMD 10K OHM 1% 1/10W 0603; Manufacturer: Yageo; Price: 0,0009; Component Name: 0603WAF1002T5E; Part Number: 0603WAF1002T5E; Tolerance: ±1%; Designator: 0603WAF1002T5E; PriceSupplier: https://lcsc.com/product-detail/Chip-Resistor-Surface-Mount_Uniroyal-Elec-0603WAF1002T5E_C25804.html; PriceQty: 100; Temperature: -55°C ~ 155°C; Simulation: RESISTOR; Pin Count: 2; HelpURL: https://lcsc.com/product-detail/Chip-Resistor-Surface-Mount_Uniroyal-Elec-0603WAF1002T5E_C25804.html; Signal Integrity: Res
R213 = CMP-00199-1: RES SMD 680k 1% 1/10W 0603; Manufacturer: Uniroyal; Temperature: -55°C ~ 155°C; HelpURL: https://lcsc.com/product-detail/Chip-Resistor-Surface-Mount_UNI-ROYAL-Uniroyal-Elec-0603WAF6803T5E_C25822.html; Signal Integrity: Res; Tolerance: 1%; PriceSupplier: https://lcsc.com/product-detail/Chip-Resistor-Surface-Mount_UNI-ROYAL-Uniroyal-Elec-0603WAF6803T5E_C25822.html; PriceQty: 100; Part Number: 0603WAF6803T5E; Pin Count: 2; Designator: 0603WAF6803T5E; Simulation: RESISTOR; Price: 0,0012; Component Name: 0603WAF6803T5E
R214 = CMP-00200-1: RES SMD 150k 1% 1/10W 0603; Manufacturer: Uniroyal; Designator: 0603WAF1503T5E; Part Number: 0603WAF1503T5E; PriceSupplier: https://lcsc.com/product-detail/Chip-Resistor-Surface-Mount_UNI-ROYAL-Uniroyal-Elec-0603WAF1503T5E_C22807.html; Tolerance: 1%; Temperature: -55°C ~ 155°C; Signal Integrity: Res; HelpURL: https://lcsc.com/product-detail/Chip-Resistor-Surface-Mount_UNI-ROYAL-Uniroyal-Elec-0603WAF1503T5E_C22807.html; PriceQty: 100; Price: 0,0012; Component Name: 0603WAF1503T5E; Pin Count: 2; Simulation: RESISTOR
U1 = CMP-00153-1: Transceiver USB 2.0 2Mbps SOP-16_150mil; Manufacturer: WCH(Jiangsu Qin Heng); HelpURL: https://lcsc.com/product-detail/USB-ICs_WCH-Jiangsu-Qin-Heng-CH340C_C84681.html; Price: 0,28; PriceQty: 100; PriceSupplier: https://lcsc.com/product-detail/USB-ICs_WCH-Jiangsu-Qin-Heng-CH340C_C84681.html; Part Number: CH340C; Component Name: CH340C; Temperature: -40°C ~ 80°C; Designator: CH340C; Pin Count: 16
U3 U4 = CMP-00203-1: IC TRANSCEIVER HALF 1/1 8SOIC; Manufacturer: XINLUDA; Price: 0,1977; Designator: XL1050; Part Number: XL1050; Temperature: -40°C ~ 150°C; PriceSupplier: https://lcsc.com/product-detail/CAN-ICs_XINLUDA-XL1050_C609746.html; Component Name: XL1050; PriceQty: 100; Pin Count: 8; HelpURL: https://lcsc.com/product-detail/CAN-ICs_XINLUDA-XL1050_C609746.html
U201 = CMP-014-0017-3: IC REG BUCK ADJ 2A SYNC TSOT25; Manufacturer: Diodes Incorporated; MarkingCode: L2F; HelpURL: https://www.digikey.com/product-detail/en/diodes-incorporated/AP3429KTTR-G1/AP3429KTTR-G1DIDKR-ND/5359847; Part Number: AP3429KTTR-G1; Price: 0,0804; PriceQty: 50; PriceSupplier: https://lcsc.com/product-detail/DC-DC-Converters_Diodes-Incorporated-AP3429KTTR-G1_C507879.html; Temperature: -40°C ~ 85°C (TA); Pin Count: 5; Component Name: AP3429KTTR-G1